# EAGLE design 74 (EAGLE 6.5.0)
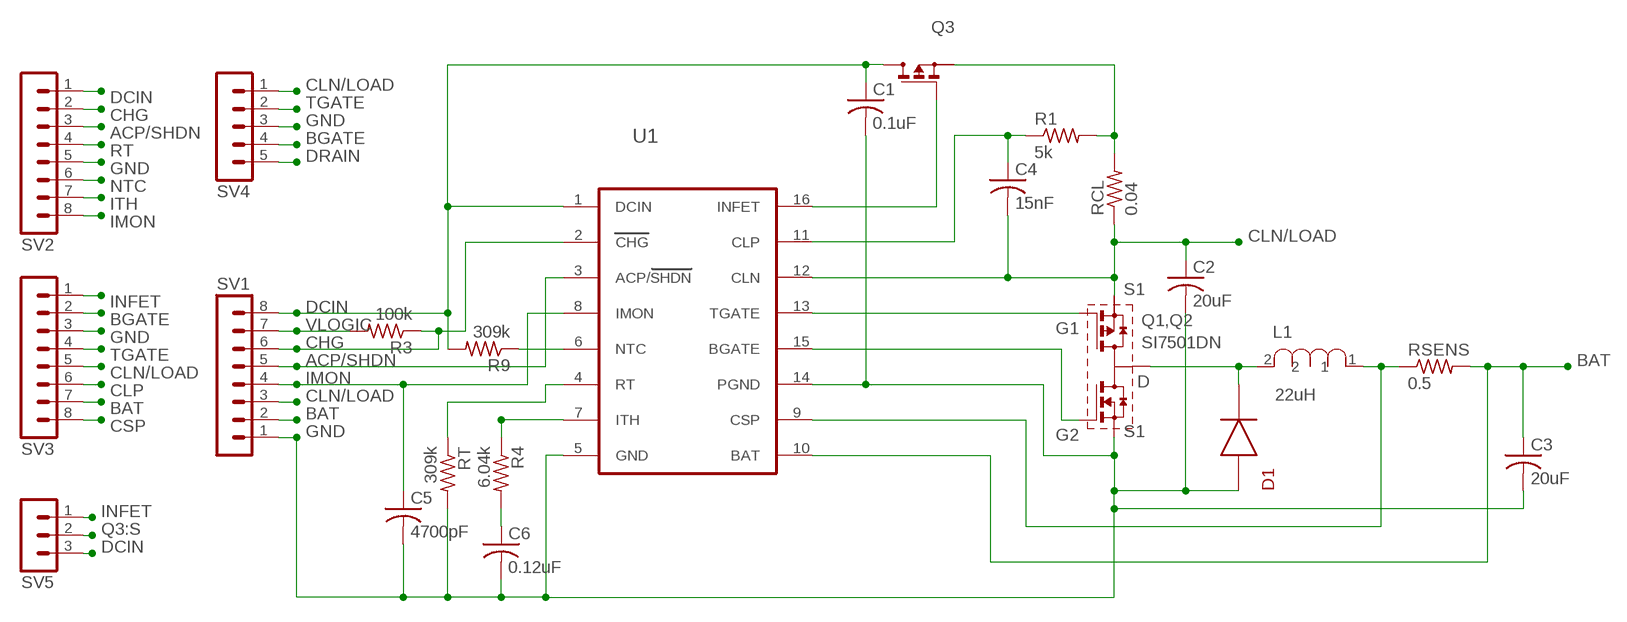
[diagram p0: schematic, sheet 1]

## Parts
C1  0.1uF  C-USC1210  [C1210]
C2  20uF  C-USC1210  [C1210]
C3  20uF  C-USC1210  [C1210]
C4  15nF  C-USC1210  [C1210]
C5  4700pF  C-USC1210  [C1210]
C6  0.12uF  C-USC1210  [C1210]
D1  DIODE  [DIODE]
L1  22uH  SDR1005INDUCTOR  [POWERINDUCTOR]
Q1,Q2  SI7501DN  [POWERPAK]
Q3  MOSFET  [SOT-23]
R1  5k  R-US_R1206  [R1206]
R3  100k  R-US_R1206  [R1206]
R4  6.04k  R-US_R1206  [R1206]
R9  309k  R-US_R1206  [R1206]
RCL  0.04  R-US_R1206  [R1206]
RSENS  0.5  0612/1632  [0612/1632]
RT  309k  R-US_R1206  [R1206]
SV1  MA08-1  [MA08-1]
SV2  MA08-1  [MA08-1]
SV3  MA08-1  [MA08-1]
SV4  MA05-1  [MA05-1]
SV5  MA03-1  [MA03-1]
U1  LTC6004  [SSOP-16]

## Nets
ACP/SHDN: SV1.5 SV2.3 U1.3(ACP/SHDN)
BAT: C3.1 RSENS.2 SV1.2 SV3.7 U1.10(BAT)
BGATE: Q1,Q2.G2 SV3.2 SV4.4 U1.15(BGATE)
CHG: R3.1 SV1.6 SV2.2 U1.2(CHG)
CLN/LOAD: C2.1 C4.2 Q1,Q2.S1 RCL.1 SV1.3 SV3.5 SV4.1 U1.12(CLN)
CLP: C4.1 R1.1 SV3.6 U1.11(CLP)
CSP: L1.1 RSENS.1 SV3.8 U1.9(CSP)
DCIN: C1.1 Q3.DRAIN(D) R9.2 SV1.8 SV2.1 SV5.3 U1.1(DCIN)
DRAIN: D1.P$2 L1.2 Q1,Q2.D SV4.5
GND: C1.2 C2.2 C3.2 C5.2 C6.2 D1.P$1 Q1,Q2.S2 RT.2 SV1.1 SV2.5 SV3.3 SV4.3 U1.5(GND) U1.14(PGND)
IMON: C5.1 SV1.4 SV2.8 U1.8(IMON)
INFET: Q3.GATE(G) SV3.1 SV5.1 U1.16(INFET)
ITH: R4.1 SV2.7 U1.7(ITH)
N$11: C6.1 R4.2
NTC: R9.1 SV2.6 U1.6(NTC)
Q3:S: Q3.SOURCE(S) R1.2 RCL.2 SV5.2
RT: RT.1 SV2.4 U1.4(RT)
TGATE: Q1,Q2.G1 SV3.4 SV4.2 U1.13(TGATE)
VLOGIC: R3.2 SV1.7

## Library data of the parts
C1-C6 = resistor:C-US: CAPACITOR, American symbol
D1 = Custom:DIODE
L1 = Custom:SDR1005INDUCTOR
Q1,Q2 = Custom:SI7501DN
Q3 = Custom:MOSFET
R1 R3 R4 R9 RCL RT = resistor:R-US_: RESISTOR, American symbol
RSENS = Custom:0612/1632
SV1-SV3 = con-lstb:MA08-1: PIN HEADER; OC_FARNELL: unknown; OC_NEWARK: unknown
SV4 = con-lstb:MA05-1: PIN HEADER; OC_FARNELL: unknown; OC_NEWARK: unknown
SV5 = con-lstb:MA03-1: PIN HEADER; OC_FARNELL: unknown; OC_NEWARK: unknown
U1 = Custom:LTC6004

## Board
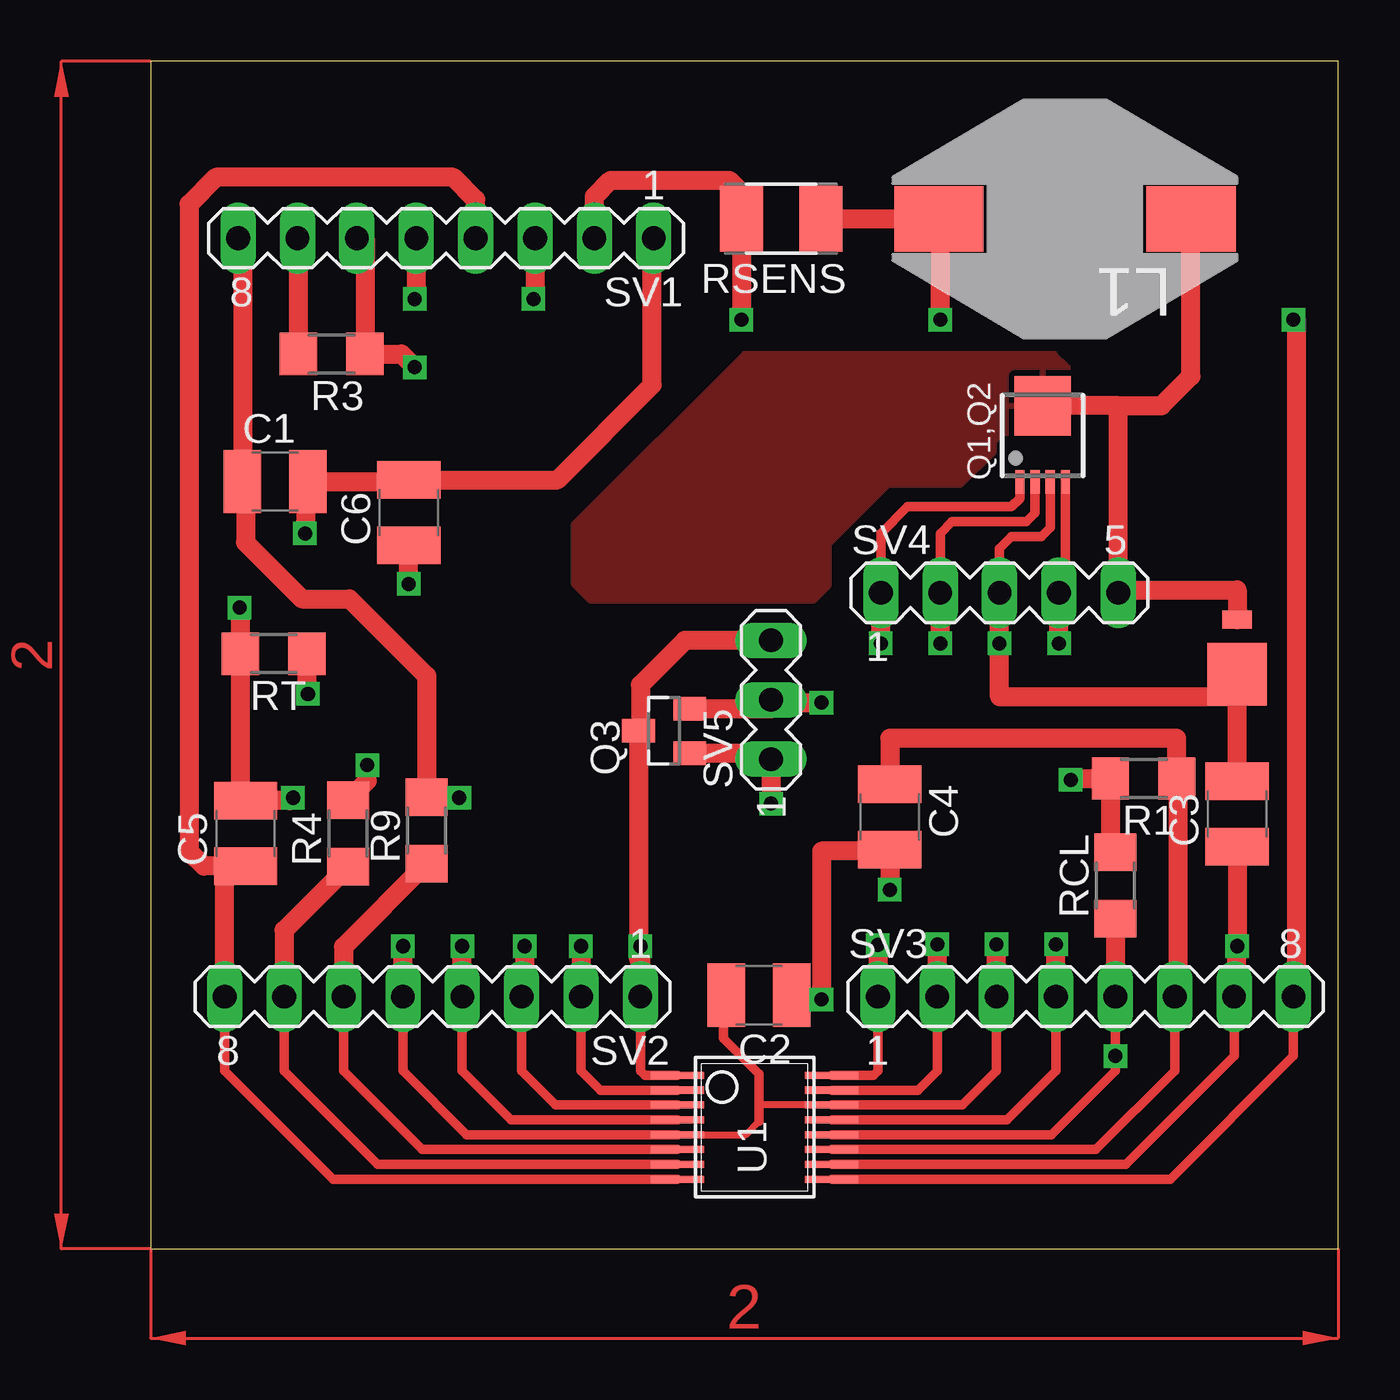
[diagram p1: board, top side]
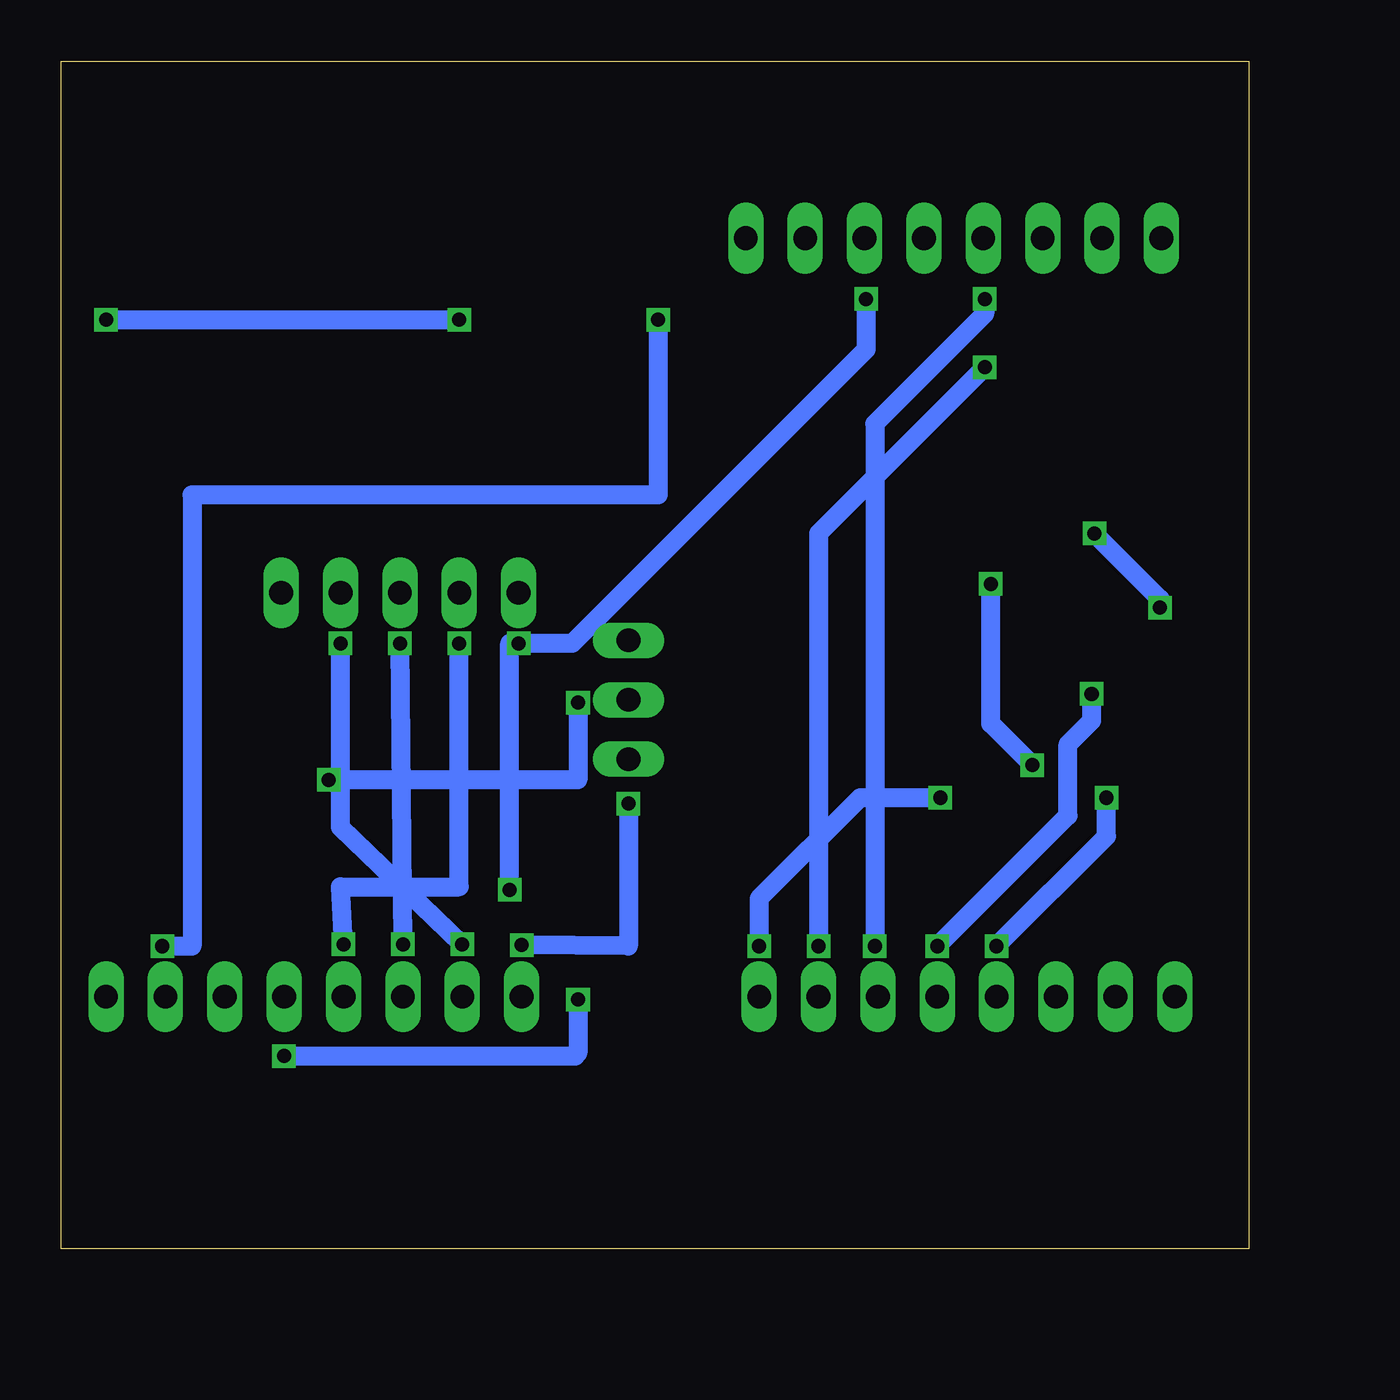
[diagram p2: board, bottom side, seen from below]

Size 50.8 x 50.8 mm. Coordinates in mm from the lower left corner, seen from the top.
Outline: 0,0 50.8,0 50.8,50.8 0,50.8 0,0
Copper layers (1*16): Top 0.035mm / dielectric 1.5mm / Bottom 0.035mm
Design rules "default": minimum track width 10mil, minimum drill 24mil, track to track 8mil, track to pad 8mil, pad to pad 8mil, via to via 8mil, smd to smd 8mil, copper to edge 40mil, drill to drill 8mil, minimum pad ring 10mil, minimum via ring 8mil, stop-mask expansion 4mil, vias tented up to drill 0mil, thermal gap 10mil

### Footprints (pad centres in the part's own frame; a part is rotated, then mirrored left to right if it is on the bottom)
C1210 = smd 1.6 x 2.7: 1 -1.4,0; 2 1.4,0
DIODE = smd 2.667 x 2.54: P$1 -1.638,0 | smd 0.762 x 1.27: P$2 0.699,0
POWERINDUCTOR = smd 3.81 x 2.794: 1 5.397,0; 2 -5.397,0
POWERPAK = smd 2.4 x 2.54: D 0,1.27 | smd 0.4 x 1.016: G1 -0.325,-1.976; G2 0.975,-1.976; S1 -0.975,-1.976; S2 0.325,-1.976
SOT-23 = smd 1 x 1.4: DRAIN 0,1.1; GATE -0.95,-1.1; SOURCE 0.95,-1.1
R1206 = smd 1.6 x 1.803: 1 -1.422,0; 2 1.422,0
0612/1632 = smd 1.84 x 2.8: 1 -1.7,0; 2 1.7,0
MA08-1 = drill 1.016 long: 1 -8.89,0; 2 -6.35,0; 3 -3.81,0; 4 -1.27,0; 5 1.27,0; 6 3.81,0; 7 6.35,0; 8 8.89,0
MA05-1 = drill 1.016 long: 1 -5.08,0; 2 -2.54,0; 3 0,0; 4 2.54,0; 5 5.08,0
MA03-1 = drill 1.016 long: 1 -2.54,0; 2 0,0; 3 2.54,0
SSOP-16 = smd 2.286 x 0.305: 1 -3.302,2.349; 2 -3.302,1.714; 3 -3.302,1.079; 4 -3.302,0.444; 5 -3.302,-0.191; 6 -3.302,-0.826; 7 -3.302,-1.461; 8 -3.302,-2.096; 9 3.302,-2.096; 10 3.302,-1.461; 11 3.302,-0.826; 12 3.302,-0.191; 13 3.302,0.444; 14 3.302,1.079; 15 3.302,1.714; 16 3.302,2.349

### Placement (x,y rotation side)
C1  5.33,32.83 0 top
C2  26.04,10.86 180 top
C3  46.48,18.61 90 top
C4  31.62,18.48 270 top
C5  4.06,17.78 90 top
C6  11.05,31.5 90 top
D1  46.48,26.23 90 top
L1  39.12,44.07 180 top
Q1,Q2  38.16,34.8 0 top
Q3  21.97,22.16 90 top
R1  42.48,20.13 180 top
R3  7.75,38.29 180 top
R4  8.45,17.78 90 top
R9  11.81,17.91 90 top
RCL  41.27,15.56 90 top
RSENS  26.99,44.07 180 top
RT  5.27,25.46 180 top
SV1  12.64,43.24 180 top
SV2  12.06,10.79 180 top
SV3  40.01,10.79 0 top
SV4  36.32,28.07 0 top
SV5  26.54,23.5 90 top
U1  25.84,5.08 0 top

### Tracks (layer width: path | path; a pad name or v marks a point on that pad's centre or on a via)
ACP/SHDN  (via drill 0.6)
  Top 0.406: U1.3 17.34,6.16 15.88,7.62 SV2.3
  Top 0.813: 15.75,10.67 SV2.3 16,10.79 v16,12.95 | SV1.5 11.37,40.7 v11.3,40.64
  Bottom 0.813: v11.3,40.64 11.3,40.01 16,35.31 v16,12.95
BAT  (via drill 0.6)
  Top 0.406: U1.10 41.72,3.62 46.35,8.26 SV3.7
  Top 0.813: 25.27,44.07 RSENS.2 | C3.1 v46.48,12.95 SV3.7 | RSENS.2 25.29,39.75 v25.27,39.75 | SV1.2 18.99,45.02 19.68,45.72 24.77,45.72 25.4,45.09 25.4,44.18 RSENS.2
  Bottom 0.813: v25.27,39.75 25.27,32.26 45.21,32.26 45.21,12.95 v46.48,12.95
BGATE  (via drill 0.6)
  Top 0.406: U1.15 32.83,6.79 33.66,7.62 SV3.2 | Q1,Q2.G2 39.14,28.34 SV4.4
  Top 0.813: SV3.2 v33.66,13.03 | v38.86,25.91 SV4.4
  Bottom 0.813: v33.66,13.03 38.86,18.03 v38.86,25.91
CHG  (via drill 0.6)
  Top 0.406: U1.2 19.24,6.79 18.41,7.62 SV2.2
  Top 0.813: SV1.6 9.17,43.24 R3.1 10.73,38.29 v11.3,37.72 | v18.41,12.95 SV2.2
  Bottom 0.813: v11.3,37.72 18.41,30.61 v18.41,12.95
CLN/LOAD  (via drill 0.6)
  Top 0.406: U1.12 38.54,4.89 41.27,7.62 v41.27,8.26 SV3.5 | Q1,Q2.S1 37.19,32.11 36.83,31.75 32.38,31.75 31.24,30.61 SV4.1
  Top 0.813: C2.1 27.43,10.67 v28.7,10.67 28.7,17.02 31.62,17.02 C4.2 v31.62,15.37 | v31.24,25.91 SV4.1 | SV1.3 16.45,40.7 v16.38,40.64 | RCL.1 SV3.5
  Bottom 0.813: v28.7,10.67 28.7,8.38 28.83,8.26 v41.27,8.26 | v31.62,15.37 31.62,25.91 v31.24,25.91 28.96,25.91 16.38,38.48 v16.38,40.64
CLP
  Top 0.406: U1.11 40.45,4.25 43.81,7.62 SV3.6
  Top 0.813: C4.1 31.62,21.84 43.9,21.84 R1.1 43.94,20.13 43.94,10.92 SV3.6
CSP  (via drill 0.6)
  Top 0.254: 34.29,44.45 L1.1 33.78,44.07
  Top 0.406: 33.66,44.07 L1.1 | U1.9 43.62,2.98 48.9,8.26 SV3.8
  Top 0.813: RSENS.1 33.66,44.07 | v48.9,39.75 49.02,39.75 49.02,10.92 SV3.8 | v33.78,39.75 33.78,44.07
  Bottom 0.813: v48.9,39.75 v33.78,39.75
DCIN  (via drill 0.6)
  Top 0.406: Q3.DRAIN 20.57,22.16 | U1.1 21.15,7.43 20.95,7.62 SV2.1
  Top 0.813: SV1.8 3.93,43.24 C1.1 4.06,32.7 4.06,30.23 6.48,27.81 8.51,27.81 11.81,24.51 R9.2 13.18,19.33 v13.21,19.3 | v20.95,12.95 20.95,12.45 | 20.95,12.45 SV2.1 | 20.95,12.45 20.87,12.45 Q3.DRAIN 20.95,22.25 20.95,24.13 22.86,26.04 SV5.3
  Bottom 0.813: v13.21,19.3 16.64,19.3 20.95,14.99 v20.95,12.95
DRAIN
  Top 0.406: 44.58,44.01 44.51,44.01 L1.2
  Top 0.813: 41.4,36.07 SV4.5 41.4,28.19 46.48,28.19 D1.P$2 | 41.4,36.07 Q1,Q2.D | 41.4,36.07 43.24,36.07 44.51,37.34 L1.2
  pour Top: 39.24,37.34 39.24,37.72 38.67,38.29 25.4,38.29 18.1,30.99 18.1,28.45 18.8,27.75 28.38,27.75 29.02,28.38 29.02,30.16 31.56,32.7 34.67,32.7 36.07,34.1 36.07,34.54 36.39,34.86 36.45,34.92 39.05,34.92 39.24,35.12
GND  (via drill 0.6)
  Top 0.305: U1.14 26.04,6.16 | 24.51,10.16 24.51,10.73 C2.2 | U1.5 25.46,4.89 26.04,5.46
  Top 0.406: 36.58,28.07 SV4.3 36.32,29.97 36.83,30.48 38.1,30.48 38.49,30.87 Q1,Q2.S2 | 24.64,10.54 C2.2 | 24.51,10.16 24.51,9.02 26.04,7.49 26.04,6.16 26.04,5.46 | U1.5 13.53,4.89 10.79,7.62 SV2.5 | U1.14 34.73,6.16 36.2,7.62 SV3.3
  Top 0.813: 10.92,10.67 SV2.5 v10.79,12.95 | v3.81,27.43 3.85,27.39 RT.2 3.85,19.31 C5.2 5.97,19.18 v6.1,19.3 | v6.6,30.61 C1.2 11.05,32.83 C6.2 17.4,32.9 21.46,36.96 21.46,43.18 SV1.1 | C2.2 | C3.2 46.48,23.62 | D1.P$1 46.48,23.62 | 46.48,23.62 36.32,23.62 v36.32,25.91 SV4.3 | SV3.3 v36.2,13.03
  Bottom 0.813: v3.81,27.43 3.81,27.81 v6.6,30.61 | v10.79,12.95 6.1,17.65 v6.1,19.3 | v36.2,13.03 v36.32,25.91
IMON
  Top 0.406: U1.8 7.81,2.98 3.17,7.62 SV2.8
  Top 0.813: C5.1 3.17,16.38 | 3.17,16.38 2.29,16.38 1.65,17.02 1.65,44.7 2.79,45.85 12.95,45.85 13.91,44.9 SV1.4 | 3.3,10.67 SV2.8 3.17,16.38
INFET  (via drill 0.6)
  Top 0.406: U1.16 30.92,7.43 31.11,7.62 SV3.1
  Top 0.813: Q3.GATE 26.54,21.21 SV5.1 v26.54,19.05 | v31.11,13.01 SV3.1
  Bottom 0.813: v26.54,19.05 26.54,12.95 v31.11,13.01
ITH
  Top 0.305: 5.71,9.27 SV2.7
  Top 0.406: U1.7 9.72,3.62 5.71,7.62 SV2.7
  Top 0.813: R4.1 5.71,13.63 SV2.7
N$11  (via drill 0.6)
  Top 0.813: R4.2 9.27,20.03 v9.27,20.7 | v11.05,28.45 C6.1
  Bottom 0.813: v9.27,20.7 11.05,22.48 v11.05,28.45
NTC
  Top 0.406: U1.6 11.62,4.25 8.26,7.62 SV2.6
  Top 0.813: R9.1 8.26,12.93 SV2.6
Q3:S  (via drill 0.6)
  Top 0.813: Q3.SOURCE 26.54,23.11 26.54,23.37 | 26.54,23.37 SV5.2 | RCL.2 41.06,16.98 R1.2 39.37,20.13 v39.37,20.07 | 26.54,23.37 v28.7,23.37
  Bottom 0.813: v28.7,23.37 28.7,20.07 v39.37,20.07
RT  (via drill 0.6)
  Top 0.406: U1.4 15.43,5.52 13.34,7.62 SV2.4
  Top 0.813: SV2.4 v13.34,12.95 | v6.73,23.75 6.69,23.79 RT.1
  Bottom 0.813: v13.34,12.95 7.75,18.54 7.75,21.59 6.73,22.61 v6.73,23.75
TGATE  (via drill 0.6)
  Top 0.406: U1.13 36.64,5.52 38.73,7.62 SV3.4 | Q1,Q2.G1 37.84,31.49 37.47,31.11 34.29,31.11 33.78,30.61 SV4.2
  Top 0.813: SV3.4 v38.73,13.03 | v33.78,25.91 SV4.2
  Bottom 0.813: v38.73,13.03 38.86,15.49 33.78,15.49 v33.78,25.91
VLOGIC
  Top 0.813: SV1.7 6.33,43.24 R3.2
(copper drawn outside any net)
  shapes: Top area x2